# Altium schematic sheet fullflex-1.SchDoc
size A3
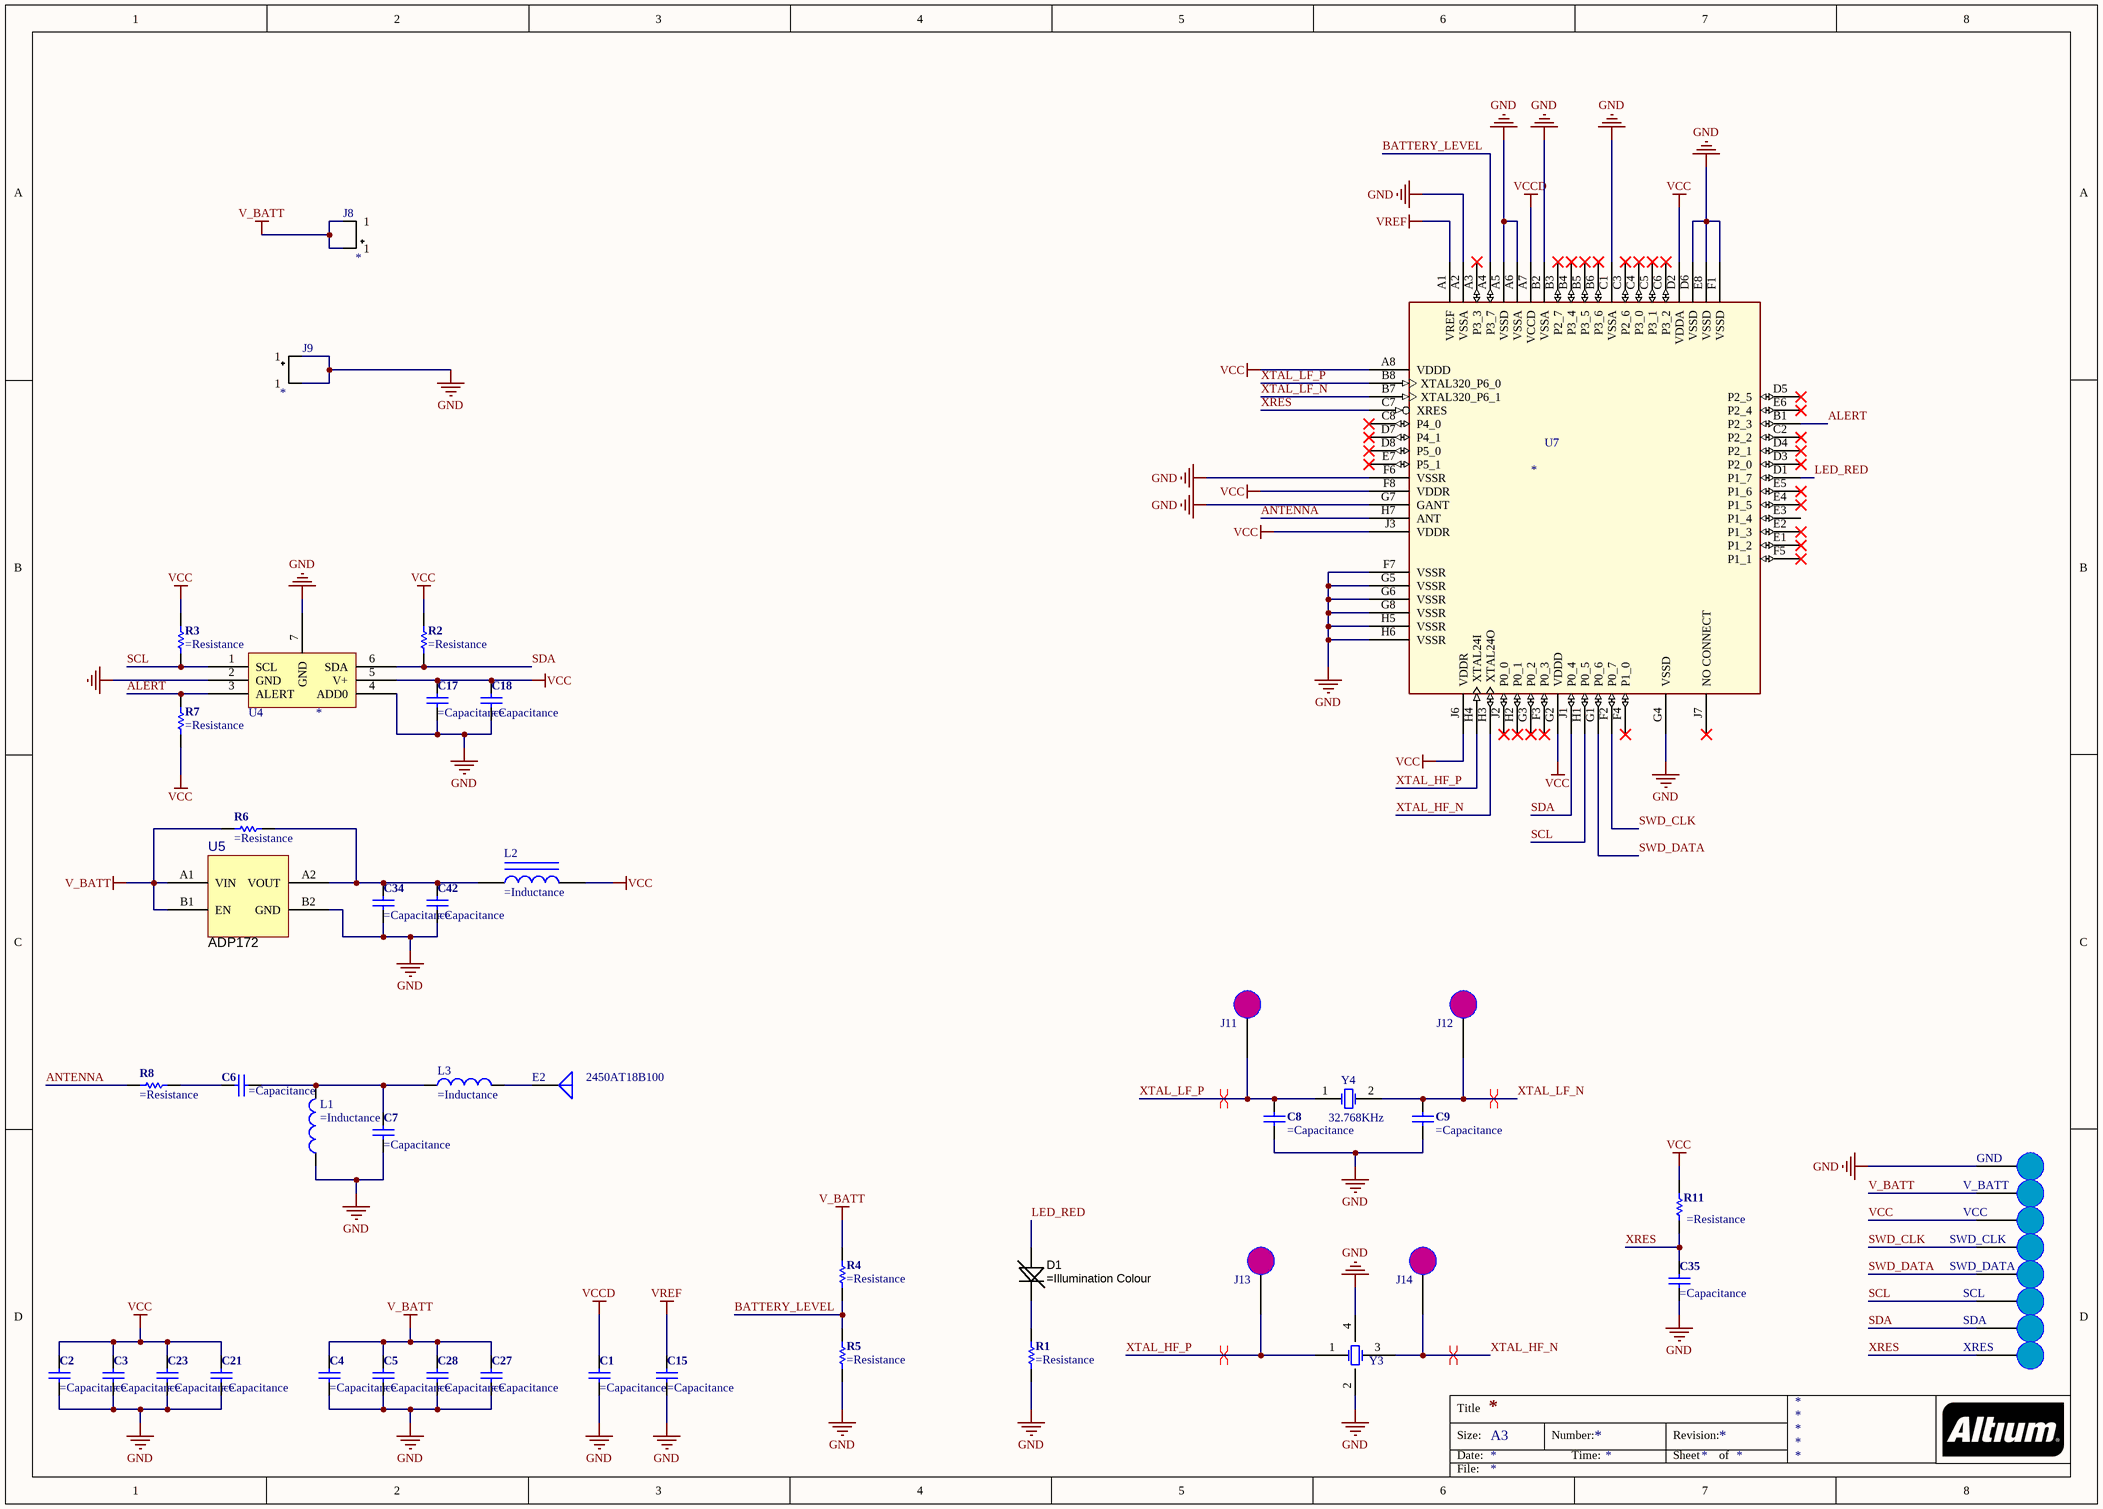
[diagram p0: fullflex-1.SchDoc]

## Parts
C1  (no value)  [CAP_0201(0603)_M]
C2  (no value)  [CAP_0402(1005)_M]
C3  (no value)  [CAP_0402(1005)_M]
C4  (no value)  [CAP_0402(1005)_M]
C5  (no value)  [CAP_0402(1005)_M]
C6  (no value)  [CAP_0402(1005)_M]
C7  (no value)  [CAP_0402(1005)_M]
C8  (no value)  [CAP_0402(1005)_M]
C9  (no value)  [CAP_0402(1005)_M]
C15  (no value)  [CAP_0201(0603)_M]
C17  (no value)  [CAP_0201(0603)_M]
C18  (no value)  [CAP_0201(0603)_M]
C21  (no value)  [CAP_0201(0603)_M]
C23  (no value)  [CAP_0201(0603)_M]
C27  (no value)  [CAP_0201(0603)_M]
C28  (no value)  [CAP_0201(0603)_M]
C34  (no value)  [CAP_0201(0603)_M]
C35  (no value)  [CAP_0201(0603)_M]
C42  (no value)  [CAP_0201(0603)_M]
D1  (no value)  [LED_0402(1005)]
E2  2450AT18B100  [2450AT18B100]
GND  *  [Pogo-Pin-Pad]  (value not drawn)
J8  *  [Battery_PAD]
J9  *  [Battery_PAD]
J11  *  [Pogo-CLOCK-PAD]  (value not drawn)
J12  *  [Pogo-CLOCK-PAD]  (value not drawn)
J13  *  [Pogo-CLOCK-PAD]  (value not drawn)
J14  *  [Pogo-CLOCK-PAD]  (value not drawn)
L1  (no value)  [IND_0402(1005)_M]
L2  (no value)  [IND_0402(1005)_M]
L3  (no value)  [IND_0402(1005)_M]
R1  (no value)  [RES_0201(0603)_M]
R2  (no value)  [RES_0201(0603)_M]
R3  (no value)  [RES_0201(0603)_M]
R4  (no value)  [RES_0201(0603)_M]
R5  (no value)  [RES_0201(0603)_M]
R6  (no value)  [RES_0402(1005)_M]
R7  (no value)  [RES_0201(0603)_M]
R8  (no value)  [RES_0402(1005)_M]
R11  (no value)  [RES_0201(0603)_M]
SCL  *  [Pogo-Pin-Pad]  (value not drawn)
SDA  *  [Pogo-Pin-Pad]  (value not drawn)
SWD_CLK  *  [Pogo-Pin-Pad]  (value not drawn)
SWD_DATA  *  [Pogo-Pin-Pad]  (value not drawn)
U4  *  [WSON-6]
U5  ADP172  [ADP172]
U7  *  [WLCSP-68]
V_BATT  *  [Pogo-Pin-Pad]  (value not drawn)
VCC  *  [Pogo-Pin-Pad]  (value not drawn)
XRES  *  [Pogo-Pin-Pad]  (value not drawn)
Y3  ECX-2236  [ECX-2236]  (value not drawn)
Y4  32.768KHz  [ABS05]

## Nets
GND: C1.2 C2.2 C3.2 C4.2 C5.2 C7.2 C8.2 C9.2 C15.2 C17.2 C18.2 C21.2 C23.2 C27.2 C28.2 C34.2 C35.2 C42.2 GND.1 J9.1 L1.1 R1.2 R5.2 U4.2(GND) U4.4(ADD0) U4.7(GND) U5.B2(GND) U7.A2(VSSA) U7.A5(VSSD) U7.A6(VSSA) U7.B2(VSSA) U7.C1(VSSA) U7.D6(VSSD) U7.E8(VSSD) U7.F1(VSSD) U7.F6(VSSR) U7.F7(VSSR) U7.G4(VSSD) U7.G5(VSSR) U7.G6(VSSR) U7.G7(GANT) U7.G8(VSSR) U7.H5(VSSR) U7.H6(VSSR) Y3.2(GND) Y3.4(GND)
V_BATT: C4.1 C5.1 C27.1 C28.1 J8.1 R4.1 R6.1 U5.A1(VIN) U5.B1(EN) V_BATT.1
VCC: C2.1 C3.1 C17.1 C18.1 C21.1 C23.1 L2.2 R2.1 R3.1 R7.2 R11.1 U4.5(V+) U7.A8(VDDD) U7.D2(VDDA) U7.F8(VDDR) U7.G2(VDDD) U7.J3(VDDR) U7.J6(VDDR) VCC.1
VCCD: C1.1 U7.A7(VCCD)
VREF: C15.1 U7.A1(VREF)
ALERT: R7.1 U4.3(ALERT) U7.B1(P2_3)
ANTENNA: R8.1 U7.H7(ANT)
BATTERY_LEVEL: R4.2 R5.1 U7.A4(P3_7)
LED_RED: D1.A U7.D1(P1_7)
SCL: R3.2 SCL.1 U4.1(SCL) U7.H1(P0_5)
SDA: R2.2 SDA.1 U4.6(SDA) U7.J1(P0_4)
SWD_CLK: SWD_CLK.1 U7.F2(P0_7)
SWD_DATA: SWD_DATA.1 U7.G1(P0_6)
XRES: C35.1 R11.2 U7.C7(XRES) XRES.1
XTAL_HF_N: J14.1 U7.H3(XTAL24O) Y3.3(OSC2)
XTAL_HF_P: J13.1 U7.H4(XTAL24I) Y3.1(OSC1)
XTAL_LF_N: C9.1 J12.1 U7.B7(XTAL320_P6_1) Y4.2(OSC2)
XTAL_LF_P: C8.1 J11.1 U7.B8(XTAL320_P6_0) Y4.1(OSC1)
NetC6_1: C6.1 R8.2
NetC6_2: C6.2 C7.1 L1.2 L3.1
NetC34_1: C34.1 C42.1 L2.1 R6.2 U5.A2(VOUT)
NetD1_K: D1.K R1.1
NetE2_1: E2.1(A) L3.2

Not connected (* = marked no-connect by the designer): U7 A3(P3_3)* B3(P2_7)* B4(P3_4)* B5(P3_5)* B6(P3_6)* C2(P2_2)* C3(P2_6)* C4(P3_0)* C5(P3_1)* C6(P3_2)* C8(P4_0)* D3(P2_0)* D4(P2_1)* D5(P2_5)* D7(P4_1)* D8(P5_0)* E1(P1_2)* E2(P1_3)* E3(P1_4) E4(P1_5)* E5(P1_6)* E6(P2_4)* E7(P5_1)* F3(P0_3)* F4(P1_0)* F5(P1_1)* G3(P0_2)* H2(P0_1)* J2(P0_0)* J7(NO_CONNECT)*

## Layout directives
differential pair: XTAL_HF_N, XTAL_HF_P, XTAL_LF_N, XTAL_LF_P

## Notes on the sheet
- Title
- Size:
- Date:
- A3
- Number:
- Time:
- Revision:
- Sheet
- of
- File:

## Library data of the parts
C1 C15 C17 C18 C21 C23 C27 C28 C34 C35 C42 = C-0201(0603): ___ OHM ___ mW 0201(0603) SMD
C2-C9 = C-0402(1005): ___ OHM ___ mW 0402(1005) SMD
D1 = LED_0402(1005): LED, 0402(1005) SMD
E2 = 2450AT18B100: 2.4 GHz BLE Antenna; Manufacturer: Johanson; Manufacturer Part Number: 2450AT18B100E; Description 1: JOHANSON TECHNOLOGY         2450AT18B100E             ANTENNA, CERAMIC, 2.45GHZ; Impedance: 50R; Bandwidth: 100MHz; Power Rating: 3W; Frequency: 2.45GHz; Number of Bands: 1; Return Loss: -9.5dB; Max Frequency: 2.5GHz; Gain: -0.5dB; Supplier 1: Digi-Key; Supplier Part Number 1: 712-1006-1-ND; Stock 1: 187598; Pricing 1: 1=0.62, 10=0.541, 25=0.4788, 100=0.4172, 250=0.3631, 500=0.309, 1000=0.2472 (USD); Mount: Surface Mount; Case/Package: CSMD; Contact Plating: Tin; Packaging: Tape and Reel; Package Quantity: 1; Max Power Dissipation: 3W; Termination: Solder; Length: 3.2mm; Height: 0.051inch; Width: 1.6mm; REACH SVHC: No SVHC; ComponentLink1URL: https://datasheet.ciiva.com/1124/1318299-1124918.pdf; ComponentLink1Description: https://datasheet.ciiva.com/1124/1318299-1124918.pdf; ComponentLink2URL: https://datasheet.ciiva.com/24025/antenna-2450at18b100-242422-24025839.pdf; ComponentLink2Description: https://datasheet.ciiva.com/24025/antenna-2450at18b100-242422-24025839.pdf
GND SCL SDA SWD_CLK SWD_DATA V_BATT VCC XRES = Probe-Pin Pad
J8 J9 = Battery_Connector
J11-J14 = Probe-CLOCK
L1 L3 = I-0402(1005)
L2 = Inductor Iron: Magnetic-Core Inductor
R1-R5 R7 R11 = R-0201(0603): ___ OHM ___ mW 0201(0603) SMD
R6 R8 = R-0402(1005): ___ OHM ___ mW 0402(1005) SMD
U4 = TMP116: TI Digital I2C Temperature Sensor; Manufacturer: Texas Instruments; Manufacturer Part Number: TMP116AIDRVT; Interface: I2C,SMBus,2-Wire; Supplier 1: Digi-Key; Supplier Part Number 1: 296-46944-1-ND; Stock 1: 995; Pricing 1: 1=4.01, 10=3.599, 100=2.9485 (USD); Min Operating Temperature: -55°C; Max Operating Temperature: 150°C
U5 = ADP172: 3V LDO; Manufacturer: Analog Devices; Manufacturer Part Number: ADP172ACBZ-3.0-R7; Description 1: Linear Voltage Regulator IC Positive Fixed 1 Output 3V 300mA 4-WLCSP (0.95x1.03); Dropout Voltage: 50mV; Number of Outputs: 1; Min Input Voltage: 1.6V; Max Input Voltage: 3.6V; Max Output Current: 300mA; Min Current Limit: 400mA; Polarity: Positive; Nominal Supply Current: 23uA; Quiescent Current: 60uA; Power Supply Rejection Ratio (PSRR): 73dB; Max Supply Current: 170uA; Min Output Voltage: 800mV; Supplier 1: Digi-Key; Supplier Part Number 1: ADP172ACBZ-3.0-R7CT-ND; Stock 1: 438; Pricing 1: 1=1.13, 10=1.013, 100=0.7896, 500=0.6523, 1000=0.515 (USD); Mount: Surface Mount; Number of Pins: 4; Contact Plating: Copper,Tin,Silver; Min Operating Temperature: -40°C; Max Operating Temperature: 125°C; Package Quantity: 3000; Packaging: Tape and Reel; Output Voltage: 3V; Output Current: 300mA; Number of Regulators: 1; Operating Supply Current: 23uA; Max Output Voltage: 3V; Radiation Hardening: No; Lead Free: Contains Lead; ComponentLink1URL: https://datasheet.ciiva.com/2056/adp172-2056690.pdf; ComponentLink1Description: https://datasheet.ciiva.com/2056/adp172-2056690.pdf; ComponentLink2URL: https://datasheet.ciiva.com/2056/adp172-2056691.pdf; ComponentLink2Description: https://datasheet.ciiva.com/2056/adp172-2056691.pdf; ComponentLink3URL: https://datasheet.ciiva.com/2056/adp172-2056692.pdf; ComponentLink3Description: https://datasheet.ciiva.com/2056/adp172-2056692.pdf; ComponentLink4URL: https://datasheet.ciiva.com/3224/adp172-3224693.pdf; ComponentLink4Description: https://datasheet.ciiva.com/3224/adp172-3224693.pdf; ComponentLink5URL: https://datasheet.ciiva.com/17365/adp172-17365245.pdf; ComponentLink5Description: https://datasheet.ciiva.com/17365/adp172-17365245.pdf; ComponentLink6URL: https://datasheet.ciiva.com/48694/001251525-da-01-en-ic-reg-ldo-adp172acbz-3-0-r7-wlcsp-4-adi-48694412.pdf; ComponentLink6Description: https://datasheet.ciiva.com/48694/001251525-da-01-en-ic-reg-ldo-adp172acbz-3-0-r7-wlcsp-4-adi-48694412.pdf
U7 = CY8C4127FNI-BL483: PSOC 4 CYBLE; Manufacturer: Cypress; Manufacturer Part Number: CY8C4247FNI-BL483T; RAM Size: 16KB; Interface: I2C,SPI,I2S,IrDA,SSP,UART,USART,LIN; Number of I/Os: 36; Number of Timers/Counters: 4; Frequency: 48MHz; Oscillator Type: Internal; Data Bus Width: 32b; Watchdog Timer: Yes; Memory Type: FLASH; Memory Size: 128KB; Peripherals: Brown-out Detect/Reset,POR,PWM,WDT,LVD,LCD; Min Supply Voltage: 1.71V; Max Supply Voltage: 5.5V; Core Architecture: ARM; Supplier 1: Digi-Key; Supplier Part Number 1: 428-4490-ND; Stock 1: 250; Pricing 1: 1=7.05, 10=6.345, 25=5.7812, 100=5.217, 250=4.794, 500=4.371, 1000=3.807, 2500=3.666 (USD); Mount: Surface Mount; Contact Plating: Copper,Tin,Silver; Min Operating Temperature: -40°C; Max Operating Temperature: 85°C; Packaging: Tape and Reel; Number of Programmable I/O: 36; Max Frequency: 48MHz; Package Quantity: 2000; Lead Free: Lead Free; ComponentLink1URL: http://www.cypress.com/?docID=50617; ComponentLink1Description: http://www.cypress.com/?docID=50617; ComponentLink2URL: http://www.cypress.com/file/137466/download; ComponentLink2Description: http://www.cypress.com/file/137466/download
Y3 = ECX-2236: 24 MHz Crystal; Manufacturer: ECS International; Manufacturer Part Number: ECS-240-8-36CKM-TR; Description 1: Crystals 24MHz 10ppm; ESR (Equivalent Series Resistance): 60R; Frequency: 24MHz; Load Capacitance: 8pF; Frequency Stability: 10ppm; Supplier 1: Digi-Key; Supplier Part Number 1: XC1557CT-ND; Stock 1: 30313; Pricing 1: 1=1.12, 10=0.987, 50=0.9224, 100=0.8151, 500=0.7722 (USD); Mount: Surface Mount; Case/Package: SMD/SMT; Min Operating Temperature: -20°C; Max Operating Temperature: 70°C; Package Quantity: 1000; Packaging: Tape and Reel; Frequency Tolerance: 10ppm; Tolerance: 10ppm; Termination: SMD/SMT; Length: 0.098inch; Height: 0.026inch; Width: 0.079inch; ComponentLink1URL: http://www.ecsxtal.com/store/pdf/partnumber4.pdf; ComponentLink1Description: http://www.ecsxtal.com/store/pdf/partnumber4.pdf; ComponentLink2URL: http://www.mouser.com/ds/2/122/ECX-2236-15751.pdf; ComponentLink2Description: http://www.mouser.com/ds/2/122/ECX-2236-15751.pdf
Y4 = ABS05: Crystal Oscillator; Manufacturer: Abracon; Manufacturer Part Number: ABS05-32.768KHZ-T; Description 1: 32.768kHz ±20ppm Crystal 12.5pF 90 kOhm -40°C ~ 85°C  Surface Mount 2-SMD; Frequency Tolerance: 20ppm; Load Capacitance: 12.5pF; ESR (Equivalent Series Resistance): 90kR; Supplier 1: Digi-Key; Supplier Part Number 1: 535-11899-1-ND; Stock 1: 92285; Pricing 1: 1=1.03, 10=0.911, 50=0.8514, 100=0.7524, 500=0.7128, 1000=0.594 (USD); Mount: Surface Mount; Case/Package: SMD/SMT; Number of Pins: 2; Min Operating Temperature: -40°C; Max Operating Temperature: 85°C; Packaging: Tape and Reel; Package Quantity: 3000; Frequency: 32.768kHz; Tolerance: 20ppm; Termination: SMD/SMT; Series Resistance: 90kR; Length: 1.6mm; Height: 0.02inch; Width: 0.039inch; Depth: 1mm; Radiation Hardening: No; REACH SVHC: No SVHC; Lead Free: Lead Free; ComponentLink1URL: https://datasheet.ciiva.com/23810/abs05-23810480.pdf; ComponentLink1Description: https://datasheet.ciiva.com/23810/abs05-23810480.pdf; ComponentLink2URL: https://datasheet.ciiva.com/6728/abs05-6728949.pdf; ComponentLink2Description: https://datasheet.ciiva.com/6728/abs05-6728949.pdf; ComponentLink3URL: https://datasheet.ciiva.com/6728/abs05-6728950.pdf; ComponentLink3Description: https://datasheet.ciiva.com/6728/abs05-6728950.pdf; ComponentLink4URL: https://datasheet.ciiva.com/16411/abs05-16411149.pdf; ComponentLink4Description: https://datasheet.ciiva.com/16411/abs05-16411149.pdf